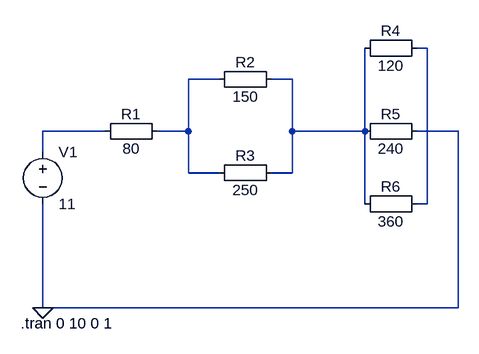
[diagram p0: schematic Versuch 1 Schaltung 2.asc]
Versuch 1 Schaltung 2.asc, the LTspice schematic file:
Version 4
SHEET 1 880 680
WIRE 624 -16 608 -16
WIRE 304 32 256 32
WIRE 416 32 384 32
WIRE 128 112 32 112
WIRE 256 112 256 32
WIRE 256 112 208 112
WIRE 416 112 416 32
WIRE 528 112 528 -16
WIRE 528 112 416 112
WIRE 672 112 608 112
WIRE 32 144 32 112
WIRE 256 176 256 112
WIRE 304 176 256 176
WIRE 416 176 416 112
WIRE 416 176 384 176
WIRE 528 224 528 112
WIRE 624 224 624 -16
WIRE 624 224 608 224
WIRE 32 384 32 224
WIRE 672 384 672 112
WIRE 672 384 32 384
FLAG 32 384 0
SYMBOL voltage 32 128 R0
SYMATTR InstName V1
SYMATTR Value 11
SYMBOL Misc\\EuropeanResistor 224 96 R90
WINDOW 0 5 56 VBottom 2
WINDOW 3 27 56 VTop 2
SYMATTR InstName R1
SYMATTR Value 80
SYMBOL Misc\\EuropeanResistor 400 16 R90
WINDOW 0 5 56 VBottom 2
WINDOW 3 27 56 VTop 2
SYMATTR InstName R2
SYMATTR Value 150
SYMBOL Misc\\EuropeanResistor 400 160 R90
WINDOW 0 5 56 VBottom 2
WINDOW 3 27 56 VTop 2
SYMATTR InstName R3
SYMATTR Value 250
SYMBOL Misc\\EuropeanResistor 624 -32 R90
WINDOW 0 5 56 VBottom 2
WINDOW 3 27 56 VTop 2
SYMATTR InstName R4
SYMATTR Value 120
SYMBOL Misc\\EuropeanResistor 624 96 R90
WINDOW 0 5 56 VBottom 2
WINDOW 3 27 56 VTop 2
SYMATTR InstName R5
SYMATTR Value 240
SYMBOL Misc\\EuropeanResistor 624 208 R90
WINDOW 0 5 56 VBottom 2
WINDOW 3 27 56 VTop 2
SYMATTR InstName R6
SYMATTR Value 360
TEXT -2 408 Left 2 !.tran 0 10 0 1

The netlist it stands for:
* Versuch 1 Schaltung 2.asc
V1 N004 0 11
R1 N002 N004 80
R2 N003 N002 150
R3 N003 N002 250
R4 N001 N003 120
R5 0 N003 240
R6 N001 N003 360
.tran 0 10 0 1
.backanno
.end